# Altium schematic sheet Power_supply.SchDoc
size A
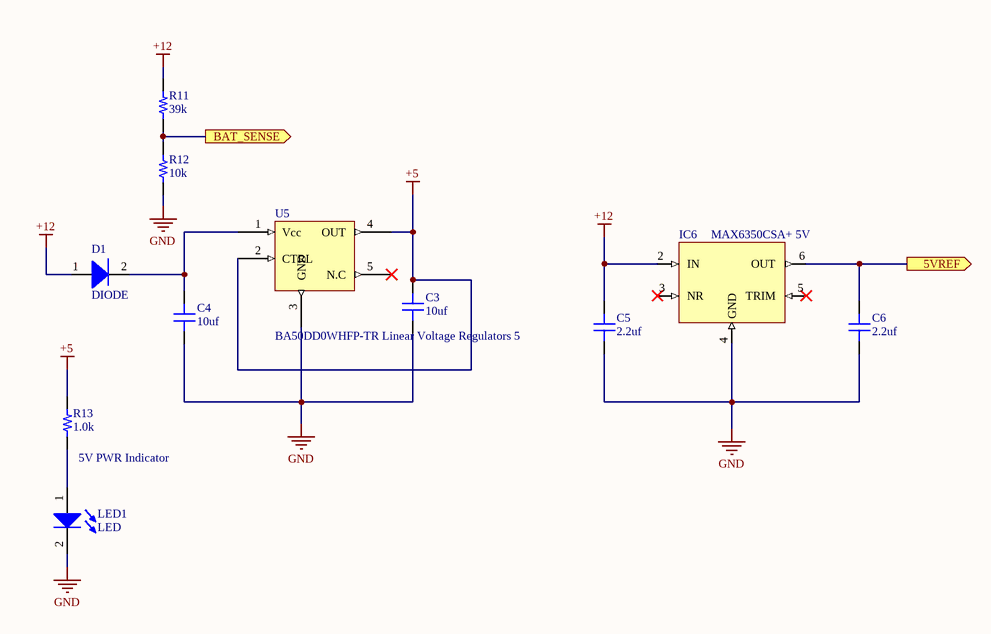
[diagram p0: Power_supply.SchDoc]

## Parts
C3  value 10uf  [CAP 0603/1608]  (hidden comment: Capacitor MLCC 10uf 16V CAP 0603/1608)
C4  value 10uf  [CAP 0603/1608]  (hidden comment: Capacitor MLCC 10uf 16V CAP 0603/1608)
C5  value 2.2uf  [CAP 0603/1608]  (hidden comment: Capacitor MLCC 2.2uf 16V CAP 0603/1608)
C6  value 2.2uf  [CAP 0603/1608]  (hidden comment: Capacitor MLCC 2.2uf 16V CAP 0603/1608)
D1  DIODE  [SOD123F]
IC6  MAX6350CSA+ 5V  [SOIC-8]
LED1  LED  [0805_LED]
R11  value 39k  [RES 0805/2012]  (hidden comment: Resistor 39k 0805 1/10W 10%)
R12  value 10k  [RES 0805/2012]  (hidden comment: Resistor 10k 0805 1/4W 10%)
R13  value 1.0k  [RES 0805/2012]  (hidden comment: Resistor 1.0k 0805 1/10W 10%)
U5  BA50DD0WHFP-TR Linear Voltage Regulators 5  [HRP5]

## Ports
5VREF (out), BAT_SENSE (out)

## Nets
+5: C3.2 R13.1 U5.2(CTRL) U5.4(OUT)
+12: C5.2 D1.1(A) IC6.2(IN) R11.2
GND: C3.1 C4.1 C5.1 C6.1 IC6.4(GND) LED1.2(K) R12.1 U5.3(GND)
5VREF: C6.2 IC6.6(OUT) ; port 5VREF
BAT_SENSE: R11.1 R12.2 ; port BAT_SENSE
NetC4_2: C4.2 D1.2(K) U5.1(Vcc)
NetLED1_1: LED1.1(A) R13.2

Not connected (* = marked no-connect by the designer): IC6 3(NR)* 5(TRIM)*; U5 5(N.C)*

## Notes on the sheet
- (near R13) 5V PWR Indicator

## Library data of the parts
C3 C4 = 235: Manufacturer_id: 1; idCapacitor: 235; Name: Cap_10uf_16V_CAP 0603/1608; Dielectric: Ceramic; Created_By: Nick Mah; Drawer_id: 1; Voltage_Rating: 16V; Package: CAP 0603/1608; Created_Date: 10/20/2018
C5 C6 = 231: Manufacturer_id: 1; idCapacitor: 231; Name: Cap_2.2uf_16V_CAP 0603/1608; Dielectric: Ceramic; Created_By: Nick Mah; Drawer_id: 1; Voltage_Rating: 16V; Package: CAP 0603/1608; Created_Date: 10/20/2018
D1 = 2: Diode Super Barrier 40V 1A Surface Mount SOD-123F; Manufacturer_id: 1; MfrPartNo: 1N5819HW1-7-F; idDiode: 2; Name: 1N5819; Drawer_id: 1; Value: 1A; Type: Super Barrier; Num_Circuits: 1; Ic: 1A; Power: 40V; Package: SOD-123; Link: https://www.digikey.com/product-detail/en/diodes-incorporated/1N5819HW1-7-F/1N5819HW1-7-FDITR-ND/5768523; ComponentLink1Description: Datasheet; ComponentLink1URL: https://www.diodes.com/assets/Datasheets/1N5819HW1.pdf; Supplier1: Digi-Key; Supplier1PartNo: 1N5819HW1-7-FDITR-ND
IC6 = 10: IC VREF SERIES 5V 8SOIC; Manufacturer_id: 1; idPMIC_Lin: 10; Name: MAX6350CSA+_5V_Ref; Vin(Max): 40V; Vout(Max): 12V; Created_By: Albert Panuco; Drawer_id: 1; Value: 5V; Output_Config: 5V; Num_Outputs: 1; Package: SOIC-8; MfrPartNo: MAX6350CSA+; Link: https://www.digikey.com/product-detail/en/maxim-integrated/MAX6350CSA/MAX6350CSA-ND/1867176; Updated_By: Albert Panuco
LED1 = 2: Manufacturer_id: 1; idLED: 2; Name: LED_0805_GREEN; Value: Green; Brightness: 35mcd; Id: 20mA; Vf: 2V; Drawer_id: 1
R11 = 2432: Manufacturer_id: 1; idResistor: 2432; Name: Res_39k_0805_1/10W_10%; Created_By: Nick Mah; Supplier 1: Digi-Key; Drawer_id: 1; Tolerance: 10%; Power: 1/10W; Package: 0805; ComponentLink1Description: Datasheet; Created_Date: 2018-10-20
R12 = 2533: Manufacturer_id: 1; idResistor: 2533; Name: Res_10k_0805_1/4W_10%; Created_By: Nick Mah; Supplier 1: Digi-Key; Drawer_id: 1; Tolerance: 10%; Power: 1/4W; Package: 0805; ComponentLink1Description: Datasheet; Created_Date: 2018-10-20
R13 = 2413: Manufacturer_id: 1; idResistor: 2413; Name: Res_1.0k_0805_1/10W_10%; Created_By: Nick Mah; Supplier 1: Digi-Key; Drawer_id: 1; Tolerance: 10%; Power: 1/10W; Package: 0805; ComponentLink1Description: Datasheet; Created_Date: 2018-10-20
U5 = 6: Manufacturer_id: 1; idPMIC_Lin: 6; Name: BA50DD0WHFP-TR Linear Voltage Regulator 5; Value: 5V; Vin(Min): 3V; Vin(Max): 33V; Current_Rating: 2A; Dropout_Voltage: 0.7V; Drawer_id: 1; Vout(Max): 5V; MfrPartNo: BA50DD0WHFP-TR; Link: https://www.mouser.com/ProductDetail/ROHM-Semiconductor/BA50DD0WHFP-TR?qs=4kLU8WoGk0sFpKnESpdNFg%3D%3D